# Altium project RC_Filters_MicroD.PrjPcb
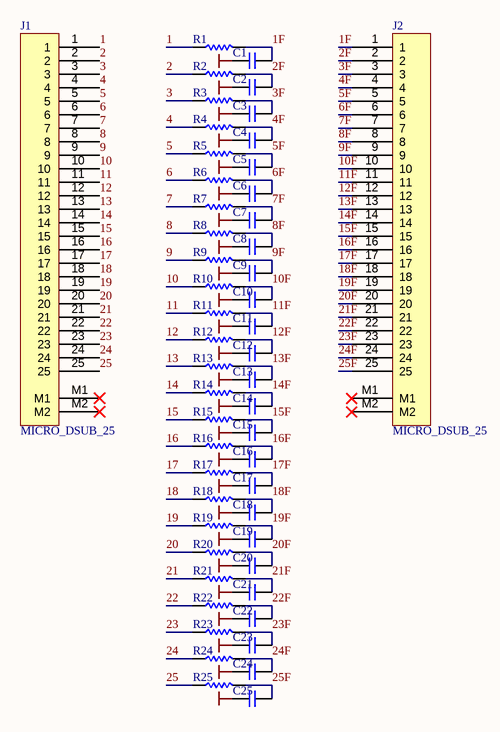
[diagram p0: RC_Filters_MicroD.SchDoc]
1 sheet, 52 parts. Net scope: global (net labels, ports and power ports of the same name join across sheets).
Board file: RC_Filters_MicroD.PcbDoc

## Sheet RC_Filters_MicroD.SchDoc
size 594 x 420 mm

### Parts
C1  Capacitor  [C0402]  (value not drawn)
C2  Capacitor  [C0402]  (value not drawn)
C3  Capacitor  [C0402]  (value not drawn)
C4  Capacitor  [C0402]  (value not drawn)
C5  Capacitor  [C0402]  (value not drawn)
C6  Capacitor  [C0402]  (value not drawn)
C7  Capacitor  [C0402]  (value not drawn)
C8  Capacitor  [C0402]  (value not drawn)
C9  Capacitor  [C0402]  (value not drawn)
C10  Capacitor  [C0402]  (value not drawn)
C11  Capacitor  [C0402]  (value not drawn)
C12  Capacitor  [C0402]  (value not drawn)
C13  Capacitor  [C0402]  (value not drawn)
C14  Capacitor  [C0402]  (value not drawn)
C15  Capacitor  [C0402]  (value not drawn)
C16  Capacitor  [C0402]  (value not drawn)
C17  Capacitor  [C0402]  (value not drawn)
C18  Capacitor  [C0402]  (value not drawn)
C19  Capacitor  [C0402]  (value not drawn)
C20  Capacitor  [C0402]  (value not drawn)
C21  Capacitor  [C0402]  (value not drawn)
C22  Capacitor  [C0402]  (value not drawn)
C23  Capacitor  [C0402]  (value not drawn)
C24  Capacitor  [C0402]  (value not drawn)
C25  Capacitor  [C0402]  (value not drawn)
J1  MICRO_DSUB_25  [581-M25-113L461]
J2  MICRO_DSUB_25  [581-M25-213L461]
R1  Resistor  [R0402]  (value not drawn)
R2  Resistor  [R0402]  (value not drawn)
R3  Resistor  [R0402]  (value not drawn)
R4  Resistor  [R0402]  (value not drawn)
R5  Resistor  [R0402]  (value not drawn)
R6  Resistor  [R0402]  (value not drawn)
R7  Resistor  [R0402]  (value not drawn)
R8  Resistor  [R0402]  (value not drawn)
R9  Resistor  [R0402]  (value not drawn)
R10  Resistor  [R0402]  (value not drawn)
R11  Resistor  [R0402]  (value not drawn)
R12  Resistor  [R0402]  (value not drawn)
R13  Resistor  [R0402]  (value not drawn)
R14  Resistor  [R0402]  (value not drawn)
R15  Resistor  [R0402]  (value not drawn)
R16  Resistor  [R0402]  (value not drawn)
R17  Resistor  [R0402]  (value not drawn)
R18  Resistor  [R0402]  (value not drawn)
R19  Resistor  [R0402]  (value not drawn)
R20  Resistor  [R0402]  (value not drawn)
R21  Resistor  [R0402]  (value not drawn)
R22  Resistor  [R0402]  (value not drawn)
R23  Resistor  [R0402]  (value not drawn)
R24  Resistor  [R0402]  (value not drawn)
R25  Resistor  [R0402]  (value not drawn)

### Nets
COM: C1.0 C2.0 C3.0 C4.0 C5.0 C6.0 C7.0 C8.0 C9.0 C10.0 C11.0 C12.0 C13.0 C14.0 C15.0 C16.0 C17.0 C18.0 C19.0 C20.0 C21.0 C22.0 C23.0 C24.0 C25.0
1: J1.1 R1.0
1F: C1.1 J2.1 R1.1
2: J1.2 R2.0
2F: C2.1 J2.2 R2.1
3: J1.3 R3.0
3F: C3.1 J2.3 R3.1
4: J1.4 R4.0
4F: C4.1 J2.4 R4.1
5: J1.5 R5.0
5F: C5.1 J2.5 R5.1
6: J1.6 R6.0
6F: C6.1 J2.6 R6.1
7: J1.7 R7.0
7F: C7.1 J2.7 R7.1
8: J1.8 R8.0
8F: C8.1 J2.8 R8.1
9: J1.9 R9.0
9F: C9.1 J2.9 R9.1
10: J1.10 R10.0
10F: C10.1 J2.10 R10.1
11: J1.11 R11.0
11F: C11.1 J2.11 R11.1
12: J1.12 R12.0
12F: C12.1 J2.12 R12.1
13: J1.13 R13.0
13F: C13.1 J2.13 R13.1
14: J1.14 R14.0
14F: C14.1 J2.14 R14.1
15: J1.15 R15.0
15F: C15.1 J2.15 R15.1
16: J1.16 R16.0
16F: C16.1 J2.16 R16.1
17: J1.17 R17.0
17F: C17.1 J2.17 R17.1
18: J1.18 R18.0
18F: C18.1 J2.18 R18.1
19: J1.19 R19.0
19F: C19.1 J2.19 R19.1
20: J1.20 R20.0
20F: C20.1 J2.20 R20.1
21: J1.21 R21.0
21F: C21.1 J2.21 R21.1
22: J1.22 R22.0
22F: C22.1 J2.22 R22.1
23: J1.23 R23.0
23F: C23.1 J2.23 R23.1
24: J1.24 R24.0
24F: C24.1 J2.24 R24.1
25: J1.25 R25.0
25F: C25.1 J2.25 R25.1

Not connected (* = marked no-connect by the designer): J1 M1* M2*; J2 M1* M2*

### Notes on the sheet
- 10
- 9
- 8
- 7
- 6
- 5
- 4
- 3
- DWG. NO.
- 2
- 1
- THIS DOCUMENT AND THE DATA DISCLOSED HEREIN OR HEREWITH IS THE PROPERTY OF ALTIUM LIMITED AND MAY BE FREELY DISTRIBUTED IN WHOLE. NO RIGHTS ARE RESERVED OR EXPRESS OR IMPLIED WARANTEE GIVEN.
- REV.
- SHT.
- REVISION
- DESCRIPTION
- DATE
- APPROVED
- H
- G
- F
- E
- D
- C
- B
- ENG:
- DSN:
- APPROVALS
- PROJECT
- DOCUMENT REVISION:
- DESIGN ITEM:
- A
- CHK:
- BOM:
- REFERENCE DOCUMENTS
- PROJECT REVISION:
- TITLE
- FAB DWG:
- PCB DWG:
- ASSY DWG:
- SCALE:
- A2
- SIZE
- CAGE CODE
- FILE NAME
- DWG NO.
- SHEET
- OF
- REV

### Library data of the parts
J1 J2 = MICRO_DSUB_25: Micro D-Sub 25 pin connector